# Altium schematic sheet Cell Monitor 12S V0.1.SchDoc
size A4; SheetNumber: 2; SheetTotal: 9
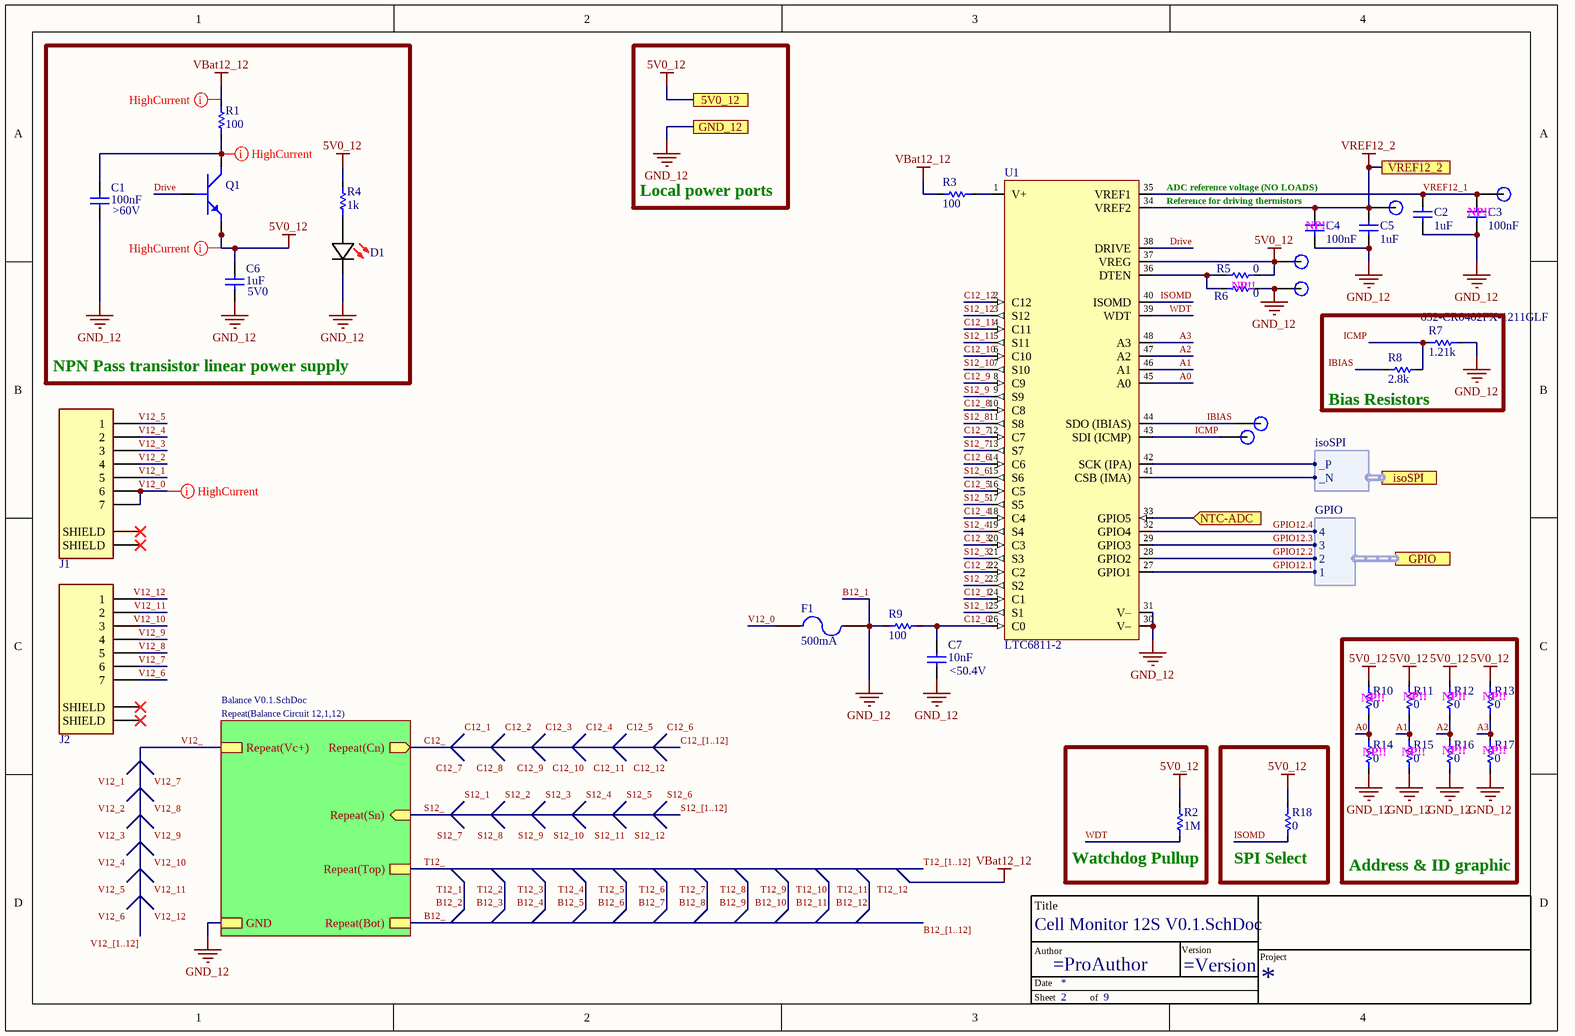
[diagram p0: Cell Monitor 12S V0.1.SchDoc]

## Parts
*  TitleBlock  (value not drawn)  (graphical)
C1  value 100nF  Voltage: >60V  [C_0402]  (hidden comment: GRM155R62A104KE14D)
C2  value 1uF  [C_0402]  (hidden comment: EMK105BJ105KV-F)
C3  value 100nF  [C_0402]  (hidden comment: GRM155R62A104KE14D)
C4  value 100nF  [C_0402]  (hidden comment: GRM155R62A104KE14D)
C5  value 1uF  [C_0402]  (hidden comment: EMK105BJ105KV-F)
C6  value 1uF  Voltage: 5V0  [C_0402]  (hidden comment: EMK105BJ105KV-F)
C7  value 10nF  Voltage: <50.4V  [C_0402]  (hidden comment: C1005X7S2A103K050BB)
D1  150060SS55040  [LED (0603)]  (value not drawn)
F1  Current Rating: 500mA  [0466.500NR]  (hidden comment: 0466.500NR)
J1  84953-7  [84953-7]  (value not drawn)
J2  84953-7  [84953-7]  (value not drawn)
NT1  NetTie  [NetTie]  (value not drawn)  (net tie, no BOM)
NT2  NetTie  [NetTie]  (value not drawn)  (net tie, no BOM)
Q1  PHPT60603NYX  [LFPAK56 (SOT669)]  (value not drawn)
R1  value 100  [R_2010]  (hidden comment: CRM2010-FX-1000ELF)
R2  value 1M  [R_0402]  (hidden comment: RC0402JR-071ML)
R3  value 100  [R_2010]  (hidden comment: CRM2010-FX-1000ELF)
R4  value 1k  [R_0402]  (hidden comment: RC0402FR-071KL)
R5  value 0  [R_0402]  (hidden comment: CR0402-J/-000GLF)
R6  value 0  [R_0402]  (hidden comment: CR0402-J/-000GLF)
R7  value 1.21k  Supplier Part Number 1: 652-CR0402FX-1211GLF  [R_0402]  (hidden comment: CR0402-FX-1211GLF)
R8  value 2.8k  [R_0402]  (hidden comment: ERJ-2RKF2801X)
R9  value 100  [R_0402]  (hidden comment: RC0402FR-07100RL)
R10  value 0  [R_0402]  (hidden comment: CR0402-J/-000GLF)
R11  value 0  [R_0402]  (hidden comment: CR0402-J/-000GLF)
R12  value 0  [R_0402]  (hidden comment: CR0402-J/-000GLF)
R13  value 0  [R_0402]  (hidden comment: CR0402-J/-000GLF)
R14  value 0  [R_0402]  (hidden comment: CR0402-J/-000GLF)
R15  value 0  [R_0402]  (hidden comment: CR0402-J/-000GLF)
R16  value 0  [R_0402]  (hidden comment: CR0402-J/-000GLF)
R17  value 0  [R_0402]  (hidden comment: CR0402-J/-000GLF)
R18  value 0  [R_0402]  (hidden comment: CR0402-J/-000GLF)
TP1  VREF1  [Test Point]  (value not drawn)  (no BOM)
TP2  VREF2  [Test Point]  (value not drawn)  (no BOM)
TP3  5V0_12  [Test Point]  (value not drawn)  (no BOM)
TP4  IBIAS  [Test Point]  (value not drawn)  (no BOM)
TP5  ICMP  [Test Point]  (value not drawn)  (no BOM)
TP13  5V0_8R  [Test Point]  (value not drawn)  (no BOM)
U1  LTC6811-2  [SSOP50P780X200-48N]

## Blocks framed on the sheet
NPN Pass transistor linear power supply: C1 C6 D1 Q1 R1 R4
Bias Resistors: R7 R8
Address & ID graphic: R10-R17
Watchdog Pullup: R2
SPI Select: R18

## Sub-sheets
Repeat(Balance Circuit 12,1,12) = Balance V0.1.SchDoc: Repeat(Bot), Repeat(Vc+), Repeat(Top), Repeat(Cn) (out), Repeat(Sn) (in), GND

## Ports
5V0_12, GND_12, GPIO (harness GPIO), isoSPI (harness isoSPI), NTC-ADC (in), VREF12_2

## Harnesses
GPIO: 1, 2, 3, 4
isoSPI: _P, _N

## Nets
5V0_12: C6.2 Q1.1(Emitter) Q1.2(Emitter) Q1.3(Emitter) R2.2 R4.2 R5.2 R10.2 R11.2 R12.2 R13.2 R18.2 TP3.1 U1.37(VREG) ; port 5V0_12
GND_12: C1.1 C2.1 C3.1 C4.1 C5.1 C6.1 C7.1 D1.1(K) F1.2 NT1.1 R6.1 R7.2 R9.1 R14.1 R15.1 R16.1 R17.1 TP13.1 U1.30(V–) U1.31(V–) ; port GND_12, sheet Repeat(Balance Circuit 12,1,12)/GND
VBat12_12: NT2.2 R1.2 R3.2
VREF12_2: C4.2 C5.2 TP2.1 U1.34(VREF2) ; port VREF12_2
A0: R10.1 R14.2 U1.45(A0)
A1: R11.1 R15.2 U1.46(A1)
A2: R12.1 R16.2 U1.47(A2)
A3: R13.1 R17.2 U1.48(A3)
B12_: sheet Repeat(Balance Circuit 12,1,12)/Repeat(Bot)
B12_1: NT1.2
C12_: sheet Repeat(Balance Circuit 12,1,12)/Repeat(Cn)
C12_0: C7.2 R9.2 U1.26(C0)
C12_1: U1.24(C1)
C12_2: U1.22(C2)
C12_3: U1.20(C3)
C12_4: U1.18(C4)
C12_5: U1.16(C5)
C12_6: U1.14(C6)
C12_7: U1.12(C7)
C12_8: U1.10(C8)
C12_9: U1.8(C9)
C12_10: U1.6(C10)
C12_11: U1.4(C11)
C12_12: U1.2(C12)
Drive: Q1.4(Base) U1.38(DRIVE)
GPIO12.1: U1.27(GPIO1) ; port GPIO.1
GPIO12.2: U1.28(GPIO2) ; port GPIO.2
GPIO12.3: U1.29(GPIO3) ; port GPIO.3
GPIO12.4: U1.32(GPIO4) ; port GPIO.4
IBIAS: R8.1 TP4.1 U1.44(SDO_(IBIAS))
ICMP: R7.1 R8.2 TP5.1 U1.43(SDI_(ICMP))
ISOMD: R18.1 U1.40(ISOMD)
NTC-ADC: U1.33(GPIO5) ; port NTC-ADC
S12_: sheet Repeat(Balance Circuit 12,1,12)/Repeat(Sn)
S12_1: U1.25(S1)
S12_2: U1.23(S2)
S12_3: U1.21(S3)
S12_4: U1.19(S4)
S12_5: U1.17(S5)
S12_6: U1.15(S6)
S12_7: U1.13(S7)
S12_8: U1.11(S8)
S12_9: U1.9(S9)
S12_10: U1.7(S10)
S12_11: U1.5(S11)
S12_12: U1.3(S12)
T12_: sheet Repeat(Balance Circuit 12,1,12)/Repeat(Top)
T12_12: NT2.1
V12_: sheet Repeat(Balance Circuit 12,1,12)/Repeat(Vc+)
V12_0: F1.1 J1.6 J1.7
V12_1: J1.5
V12_2: J1.4
V12_3: J1.3
V12_4: J1.2
V12_5: J1.1
V12_6: J2.7
V12_7: J2.6
V12_8: J2.5
V12_9: J2.4
V12_10: J2.3
V12_11: J2.2
V12_12: J2.1
VREF12_1: C2.2 C3.2 TP1.1 U1.35(VREF1)
WDT: R2.1 U1.39(WDT)
NetC1_2: C1.2 Q1.5(Collector) R1.1
NetD1_2: D1.2(A) R4.1
NetR3_1: R3.1 U1.1(V+)
NetR5_1: R5.1 R6.2 U1.36(DTEN)
NetU1_41: U1.41(CSB_(IMA)) ; port isoSPI._N
NetU1_42: U1.42(SCK_(IPA)) ; port isoSPI._P

Not connected (* = marked no-connect by the designer): J1 S1(SHIELD)* S2(SHIELD)*; J2 S1(SHIELD)* S2(SHIELD)*

## Buses and harness runs
bus B12_[1..12]
bus C12_[1..12]
bus S12_[1..12]
bus T12_[1..12]
bus V12_[1..12]

## Layout directives
net class HighCurrent; Current: >50mA: 5V0_12, NetC1_2, V12_0, VBat12_12

## Notes on the sheet
- Local power ports
- ADC reference voltage (NO LOADS)
- (near C4) Reference for driving thermistors
- (near C4) NP!!
- (near C3) NP!!
- (near R6) NP!!
- (near R10) NP!!
- (near R11) NP!!
- (near R12) NP!!
- (near R13) NP!!
- (near R14) NP!!
- (near R15) NP!!
- (near R16) NP!!
- (near R17) NP!!
- Labels drawn without touching a wire or pin: C12_1, C12_2, C12_3, C12_4, C12_5, C12_6, C12_7, C12_8, C12_9, C12_10, C12_11, C12_12, S12_1, S12_2, S12_3, S12_4, S12_5, S12_6, S12_7, S12_8, S12_9, S12_10, S12_11, S12_12, V12_1, V12_2, V12_3, V12_4, V12_5, V12_6, V12_7, V12_8, V12_9, V12_10, V12_11, V12_12
- (in symbol TitleBlock) Title; Author; Version; Project; Date; Sheet; of

## Library data of the parts
C1-C7 = Capacitor: ComponentLink1Description: New link; ComponentLink1URL: *
  C1 C3 C4: Manufacture Part Number 1: GRM155R62A104KE14D
D1 = 150060SS55040: LED RED DIFFUSED 0603 SMD; Manufacturer: Wurth Electronics; Lens Style: Flat; Luminous Intensity: 70mcd; Forward Voltage: 2V; Test Current: 20mA; Viewing Angle: 140°; Dominant Wavelength: 630nm; Lens Size: 0.8mm; Supplier 1: Mouser; Manufacturer Part Number: 150060SS55040; RoHS: No; Category: LEDs; Stock 1: 17006; Pricing 1: 1=0.18000, 10=0.16800, 50=0.16800, 100=0.15200, 1000=0.12100, 10000=0.10600 (USD); Mount: Surface Mount; Case/Package: 0603; Color: Red; Case Code (Imperial): 0603; Case Code (Metric): 1608; Packaging: Tape and Reel; Lens Transparency: Diffused; Length: 1.6mm; Width: 0.8mm; Height: 0.5mm; RoHS Compliant: No; Supplier Part Number 1: 710-150060SS55040
F1 = Fuse 2: LITTELFUSE - 0466.500NR - Fuse, Surface Mount, 500 mA, 466 Series, 63 VAC, 63 VDC, Very Fast Acting, 1206; Body Material: Thermoplastic; Voltage Rating (AC): 63V; Resistance: 350mR; DC Cold Resistance: 248mR; Fuse Type: Board Mount (Cartridge Style Excluded); Approvals: UL,CSA; Published: 8-Jun-2000; LatestRevisionDate: 17-Jul-2002; LatestRevisionNote: Re-released for DXP Platform.; PackageReference: PIN-W2/E2.8; Publisher: Altium Limited; PackageDescription: Thru-Hole; 2 Leads; Supplier 1: Mouser; Supplier Part Number 1: 576-0466.500NR; Manufacturer: Littelfuse; Manufacturer Part Number: 0466.500NR; RoHS: Yes; Category: Fuses; Stock 1: 36497; Pricing 1: 1=0.77000, 10=0.59200, 50=0.59200, 100=0.48900, 1000=0.41600, 10000=0.39000 (USD); Mount: Surface Mount; Case/Package: 1206; Number of Pins: 2; Case Code (Metric): 3216; Case Code (Imperial): 1206; Housing Material: Ceramic; Terminal Material: Copper; Min Operating Temperature: -55°C; Max Operating Temperature: 90°C; Packaging: Tape and Reel; Package Quantity: 5000; Voltage Rating (DC): 63V; Series: 466; Voltage Rating: 63V; Termination: SMD/SMT; Fuse Current: 500mA; Working Voltage: 63V; Length: 3.18mm; Width: 0.06inch; Height: 0.023inch; Depth: 1.52mm; Radiation Hardening: No; RoHS Compliant: Yes; REACH SVHC: Unknown; Lead Free: Lead Free; ComponentLink1URL: https://datasheet.ciiva.com/17081/0466-500nr-17081083.pdf?src-supplier=Allied+Electronics; ComponentLink1Description: https://datasheet.ciiva.com/17081/0466-500nr-17081083.pdf?src-supplier=Allied+Electronics; ComponentLink2URL: https://datasheet.ciiva.com/16327/littelfuse-fuse-466-16327478.pdf?src-supplier=Future+Electronics; ComponentLink2Description: https://datasheet.ciiva.com/16327/littelfuse-fuse-466-16327478.pdf?src-supplier=Future+Electronics; ComponentLink3URL: https://datasheet.ciiva.com/299/466seriesdrawing-299207.pdf?src-supplier=Digi-Key; ComponentLink3Description: https://datasheet.ciiva.com/299/466seriesdrawing-299207.pdf?src-supplier=Digi-Key; ComponentLink4URL: https://datasheet.ciiva.com/299/466seriesdrawing-299208.pdf?src-supplier=Digi-Key; ComponentLink4Description: https://datasheet.ciiva.com/299/466seriesdrawing-299208.pdf?src-supplier=Digi-Key; ComponentLink5URL: https://datasheet.ciiva.com/299/466seriesdrawing-299209.pdf?src-supplier=Digi-Key; ComponentLink5Description: https://datasheet.ciiva.com/299/466seriesdrawing-299209.pdf?src-supplier=Digi-Key; ComponentLink6URL: https://datasheet.ciiva.com/14102/ei466-dat-e-14102891.pdf?src-supplier=Distrelec; ComponentLink6Description: https://datasheet.ciiva.com/14102/ei466-dat-e-14102891.pdf?src-supplier=Distrelec; ComponentLink7URL: https://datasheet.ciiva.com/15186/getdatasheetpartid-57351-15186924.pdf?src-supplier=Verical; ComponentLink7Description: https://datasheet.ciiva.com/15186/getdatasheetpartid-57351-15186924.pdf?src-supplier=Verical
J1 J2 = 84953-7: FPC Connectors, Flex-to-Board, 7 Position, .039 in [1 mm] Centerline, Zero Insertion Force (ZIF), Right Angle, Surface Mount; Manufacturer: TE Connectivity; Current Rating: 1A; Number of Contacts: 7; Shielding: Unshielded; Gender: Female; Voltage Rating: 200V; Connector Type: Receptacle,Connector,Socket; Wire/Cable Type: Flat Flex; Mating Alignment: Yes (With); PCB Mount Alignment: No (Without); PCB Mount Retention: With; Contact Location: Top; Pitch: 0.039inch; Plating Thickness: 2um; Supplier 1: Mouser; Manufacturer Part Number: 84953-7; RoHS: Yes; Category: FFC / FPC; Pricing 1: 1=0.96000, 10=0.78800, 50=0.78800, 100=0.68800, 500=0.59100, 1000=0.52600, 1500=0.47600, 4500=0.45900, 9000=0.43600, 10000=0.43600, 24000=0.42600 (USD); Mount: Surface Mount; Contact Material: Bronze; Contact Plating: Tin,Bright; Housing Color: Natural; Housing Material: Polymer; Min Operating Temperature: -40°C; Max Operating Temperature: 85°C; Termination: SMD/SMT; Package Quantity: 1500; Number of Rows: 1; Packaging: Tape and Reel; Orientation: Right Angle; Number of Positions: 7; Connector System: Flex-to-Board; PCB Mounting Orientation: Right Angle; Sealable: No (Without); Shrouded: Yes (With); Contact Current Rating: 1A; Max Voltage Rating (AC): 200V; Series: FPC; Length: 0.5866inch; Width: 0.2575inch; Height: 2.56mm; Depth: 7.3mm; Radiation Hardening: No; ELV: Compliant; REACH SVHC: Unknown; Flammability Rating: UL94 V-0; RoHS Compliant: Yes; ComponentLink1URL: https://datasheet.ciiva.com/669/eng-cd-84953-a3-669227.pdf?src-supplier=Digi-Key; ComponentLink1Description: https://datasheet.ciiva.com/669/eng-cd-84953-a3-669227.pdf?src-supplier=Digi-Key; ComponentLink2URL: https://datasheet.ciiva.com/669/eng-cd-84953-a3-669228.pdf?src-supplier=Digi-Key; ComponentLink2Description: https://datasheet.ciiva.com/669/eng-cd-84953-a3-669228.pdf?src-supplier=Digi-Key; ComponentLink3URL: https://datasheet.ciiva.com/30243/eng-ds-1-1773440-6-0506-30243340.pdf?src-supplier=Onlinecomponents.com; ComponentLink3Description: https://datasheet.ciiva.com/30243/eng-ds-1-1773440-6-0506-30243340.pdf?src-supplier=Onlinecomponents.com; ComponentLink4URL: https://datasheet.ciiva.com/16659/eng-ds-1-1773440-6-0506-16659033.pdf?src-supplier=Avnet+Europe; ComponentLink4Description: https://datasheet.ciiva.com/16659/eng-ds-1-1773440-6-0506-16659033.pdf?src-supplier=Avnet+Europe; ComponentLink5URL: https://datasheet.ciiva.com/669/eng-cd-84953-a3-669226.pdf?src-supplier=Digi-Key; ComponentLink5Description: https://datasheet.ciiva.com/669/eng-cd-84953-a3-669226.pdf?src-supplier=Digi-Key; ComponentLink6URL: https://datasheet.ciiva.com/15177/getdatasheetpartid-565061-15177031.pdf?src-supplier=Verical; ComponentLink6Description: https://datasheet.ciiva.com/15177/getdatasheetpartid-565061-15177031.pdf?src-supplier=Verical; ComponentLink7URL: https://datasheet.ciiva.com/10034/eng-ds-1-1773440-6-0506-10034350.pdf?src-supplier=Avnet; ComponentLink7Description: https://datasheet.ciiva.com/10034/eng-ds-1-1773440-6-0506-10034350.pdf?src-supplier=Avnet; Supplier Part Number 1: 571-84953-7
Q1 = PHPT60603NYX: 60V, 3 A NPN high power bipolar transistor
R1-R18 = Resistor
  R7: Supplier 1: Mouser
TP1-TP5 TP13 = Test Point: 1.2mm Test point
U1 = LTC6811-2: 12 Channel Multicell Battery Monitor with Addressable Interface